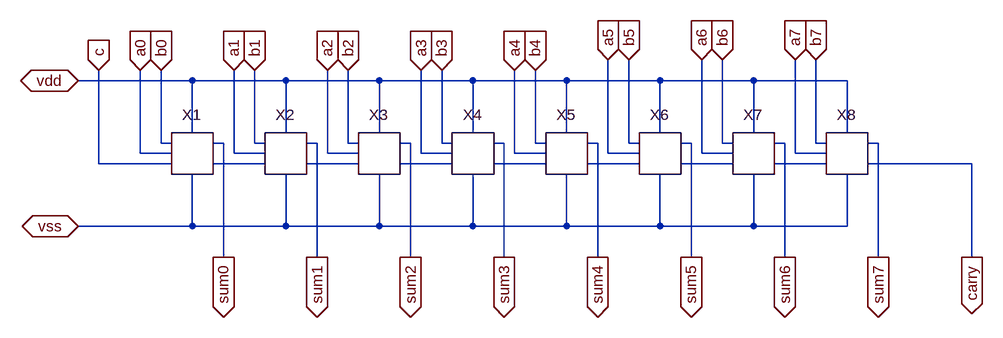
[diagram p0: schematic 8_bit_adder.asc]
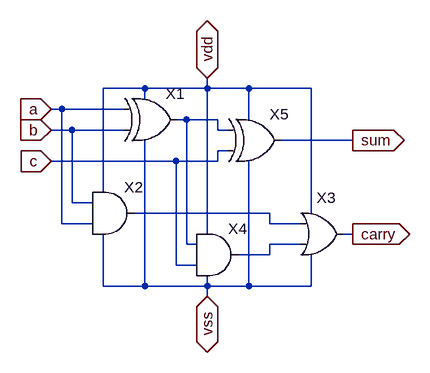
[diagram p1: sub-circuit full_adder.asc]
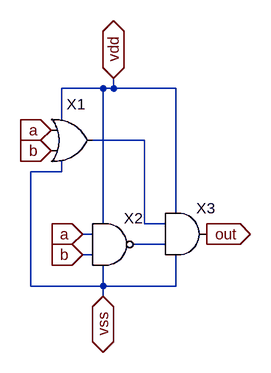
[diagram p2: sub-circuit xor.asc]
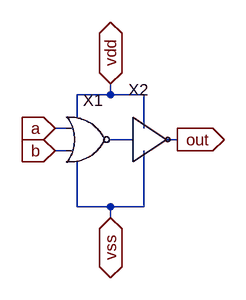
[diagram p3: sub-circuit or.asc]
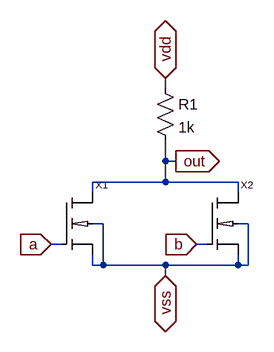
[diagram p4: sub-circuit nor.asc]
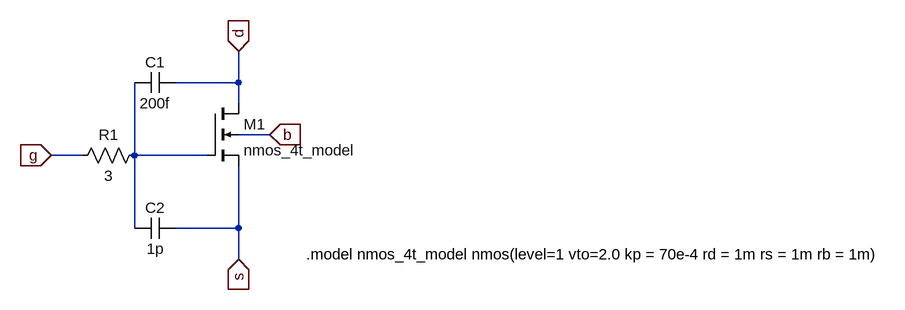
[diagram p5: sub-circuit nmos_4t.asc]
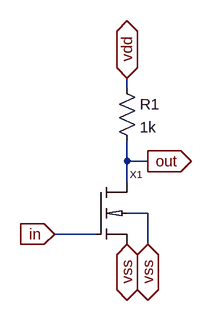
[diagram p6: sub-circuit not.asc]
8_bit_adder.asc, the LTspice schematic file:
Version 4
SHEET 1 1636 1396
WIRE 208 -96 32 -96
WIRE 352 -96 208 -96
WIRE 496 -96 352 -96
WIRE 640 -96 496 -96
WIRE 784 -96 640 -96
WIRE 928 -96 784 -96
WIRE 1072 -96 928 -96
WIRE 1216 -96 1072 -96
WIRE 208 -16 208 -96
WIRE 352 -16 352 -96
WIRE 496 -16 496 -96
WIRE 640 -16 640 -96
WIRE 784 -16 784 -96
WIRE 928 -16 928 -96
WIRE 1072 -16 1072 -96
WIRE 1216 -16 1216 -96
WIRE 160 0 160 -112
WIRE 176 0 160 0
WIRE 256 0 240 0
WIRE 304 0 304 -112
WIRE 320 0 304 0
WIRE 400 0 384 0
WIRE 448 0 448 -112
WIRE 464 0 448 0
WIRE 544 0 528 0
WIRE 592 0 592 -112
WIRE 608 0 592 0
WIRE 688 0 672 0
WIRE 736 0 736 -112
WIRE 752 0 736 0
WIRE 832 0 816 0
WIRE 880 0 880 -128
WIRE 896 0 880 0
WIRE 976 0 960 0
WIRE 1024 0 1024 -128
WIRE 1040 0 1024 0
WIRE 1120 0 1104 0
WIRE 1168 0 1168 -128
WIRE 1184 0 1168 0
WIRE 1264 0 1248 0
WIRE 128 16 128 -112
WIRE 176 16 128 16
WIRE 272 16 272 -112
WIRE 320 16 272 16
WIRE 416 16 416 -112
WIRE 464 16 416 16
WIRE 560 16 560 -112
WIRE 608 16 560 16
WIRE 704 16 704 -112
WIRE 752 16 704 16
WIRE 848 16 848 -128
WIRE 896 16 848 16
WIRE 992 16 992 -128
WIRE 1040 16 992 16
WIRE 1136 16 1136 -128
WIRE 1184 16 1136 16
WIRE 64 32 64 -112
WIRE 176 32 64 32
WIRE 320 32 240 32
WIRE 464 32 384 32
WIRE 608 32 528 32
WIRE 752 32 672 32
WIRE 896 32 816 32
WIRE 1040 32 960 32
WIRE 1184 32 1104 32
WIRE 1408 32 1248 32
WIRE 208 128 208 48
WIRE 208 128 32 128
WIRE 352 128 352 48
WIRE 352 128 208 128
WIRE 496 128 496 48
WIRE 496 128 352 128
WIRE 640 128 640 48
WIRE 640 128 496 128
WIRE 784 128 784 48
WIRE 784 128 640 128
WIRE 928 128 928 48
WIRE 928 128 784 128
WIRE 1072 128 1072 48
WIRE 1072 128 928 128
WIRE 1216 128 1216 48
WIRE 1216 128 1072 128
WIRE 256 176 256 0
WIRE 400 176 400 0
WIRE 544 176 544 0
WIRE 688 176 688 0
WIRE 832 176 832 0
WIRE 976 176 976 0
WIRE 1120 176 1120 0
WIRE 1264 176 1264 0
WIRE 1408 176 1408 32
FLAG 128 -112 a0
IOPIN 128 -112 In
FLAG 160 -112 b0
IOPIN 160 -112 In
FLAG 256 176 sum0
IOPIN 256 176 Out
FLAG 400 176 sum1
IOPIN 400 176 Out
FLAG 544 176 sum2
IOPIN 544 176 Out
FLAG 688 176 sum3
IOPIN 688 176 Out
FLAG 832 176 sum4
IOPIN 832 176 Out
FLAG 976 176 sum5
IOPIN 976 176 Out
FLAG 1120 176 sum6
IOPIN 1120 176 Out
FLAG 1264 176 sum7
IOPIN 1264 176 Out
FLAG 1408 176 carry
IOPIN 1408 176 Out
FLAG 272 -112 a1
IOPIN 272 -112 In
FLAG 304 -112 b1
IOPIN 304 -112 In
FLAG 416 -112 a2
IOPIN 416 -112 In
FLAG 448 -112 b2
IOPIN 448 -112 In
FLAG 560 -112 a3
IOPIN 560 -112 In
FLAG 592 -112 b3
IOPIN 592 -112 In
FLAG 704 -112 a4
IOPIN 704 -112 In
FLAG 736 -112 b4
IOPIN 736 -112 In
FLAG 848 -128 a5
IOPIN 848 -128 In
FLAG 880 -128 b5
IOPIN 880 -128 In
FLAG 992 -128 a6
IOPIN 992 -128 In
FLAG 1024 -128 b6
IOPIN 1024 -128 In
FLAG 1136 -128 a7
IOPIN 1136 -128 In
FLAG 1168 -128 b7
IOPIN 1168 -128 In
FLAG 32 -96 vdd
IOPIN 32 -96 BiDir
FLAG 32 128 vss
IOPIN 32 128 BiDir
FLAG 64 -112 c
IOPIN 64 -112 In
SYMBOL full_adder 208 0 R0
SYMATTR InstName X1
SYMBOL full_adder 352 0 R0
SYMATTR InstName X2
SYMBOL full_adder 496 0 R0
SYMATTR InstName X3
SYMBOL full_adder 640 0 R0
SYMATTR InstName X4
SYMBOL full_adder 784 0 R0
SYMATTR InstName X5
SYMBOL full_adder 928 0 R0
SYMATTR InstName X6
SYMBOL full_adder 1072 0 R0
SYMATTR InstName X7
SYMBOL full_adder 1216 0 R0
SYMATTR InstName X8

full_adder.asc, the sub-circuit schematic file:
Version 4
SHEET 1 880 680
WIRE 128 128 64 128
WIRE 224 128 224 112
WIRE 224 128 128 128
WIRE 288 128 224 128
WIRE 384 128 288 128
WIRE 128 144 128 128
WIRE 0 160 -16 160
WIRE 96 160 0 160
WIRE 192 176 176 176
WIRE 240 176 192 176
WIRE 288 176 288 128
WIRE 16 192 -16 192
WIRE 96 192 16 192
WIRE 240 192 240 176
WIRE 256 192 240 192
WIRE 448 208 336 208
WIRE 256 224 240 224
WIRE 176 240 -16 240
WIRE 240 240 240 224
WIRE 240 240 176 240
WIRE 64 288 64 128
WIRE 16 304 16 192
WIRE 48 304 16 304
WIRE 320 320 112 320
WIRE 384 320 384 128
WIRE 0 336 0 160
WIRE 48 336 0 336
WIRE 320 336 320 320
WIRE 368 336 320 336
WIRE 224 352 224 128
WIRE 448 352 432 352
WIRE 192 368 192 176
WIRE 208 368 192 368
WIRE 368 368 320 368
WIRE 320 384 320 368
WIRE 320 384 272 384
WIRE 176 400 176 240
WIRE 208 400 176 400
WIRE 64 432 64 352
WIRE 128 432 128 208
WIRE 128 432 64 432
WIRE 224 432 224 416
WIRE 224 432 128 432
WIRE 288 432 288 240
WIRE 288 432 224 432
WIRE 384 432 384 384
WIRE 384 432 288 432
WIRE 224 448 224 432
FLAG -16 160 a
IOPIN -16 160 In
FLAG -16 192 b
IOPIN -16 192 In
FLAG 224 448 vss
IOPIN 224 448 BiDir
FLAG 224 112 vdd
IOPIN 224 112 BiDir
FLAG -16 240 c
IOPIN -16 240 In
FLAG 448 208 sum
IOPIN 448 208 Out
FLAG 448 352 carry
IOPIN 448 352 Out
SYMBOL xor 144 112 R0
SYMATTR InstName X1
SYMBOL and 80 256 R0
SYMATTR InstName X2
SYMBOL and 240 320 R0
SYMATTR InstName X4
SYMBOL xor 304 144 R0
SYMATTR InstName X5
SYMBOL or 400 288 R0
SYMATTR InstName X3

xor.asc, the sub-circuit schematic file:
Version 4
SHEET 1 880 680
WIRE 208 -144 144 -144
WIRE 224 -144 224 -160
WIRE 224 -144 208 -144
WIRE 320 -144 224 -144
WIRE 144 -96 144 -144
WIRE 272 -64 192 -64
WIRE 144 -16 144 -32
WIRE 144 -16 96 -16
WIRE 320 48 320 -144
WIRE 208 64 208 -144
WIRE 272 64 272 -64
WIRE 304 64 272 64
WIRE 192 80 176 80
WIRE 304 96 256 96
WIRE 192 112 176 112
WIRE 96 160 96 -16
WIRE 208 160 208 128
WIRE 208 160 96 160
WIRE 320 160 320 112
WIRE 320 160 208 160
WIRE 208 176 208 160
FLAG 128 -80 a
IOPIN 128 -80 In
FLAG 176 80 a
IOPIN 176 80 In
FLAG 176 112 b
IOPIN 176 112 In
FLAG 128 -48 b
IOPIN 128 -48 In
FLAG 368 80 out
IOPIN 368 80 Out
FLAG 224 -160 vdd
IOPIN 224 -160 BiDir
FLAG 208 176 vss
IOPIN 208 176 BiDir
SYMBOL nand 224 32 R0
SYMATTR InstName X2
SYMBOL or 160 -128 R0
SYMATTR InstName X1
SYMBOL and 336 16 R0
SYMATTR InstName X3

or.asc, the sub-circuit schematic file:
Version 4
SHEET 1 880 680
WIRE 176 80 176 64
WIRE 176 80 128 80
WIRE 224 80 176 80
WIRE 128 112 128 80
WIRE 112 128 96 128
WIRE 224 128 224 80
WIRE 208 144 176 144
WIRE 272 144 256 144
WIRE 112 160 96 160
WIRE 128 240 128 176
WIRE 176 240 128 240
WIRE 224 240 224 160
WIRE 224 240 176 240
WIRE 176 256 176 240
FLAG 272 144 out
IOPIN 272 144 Out
FLAG 176 64 vdd
IOPIN 176 64 BiDir
FLAG 176 256 vss
IOPIN 176 256 BiDir
FLAG 96 128 a
IOPIN 96 128 In
FLAG 96 160 b
IOPIN 96 160 In
SYMBOL nor 144 80 R0
SYMATTR InstName X1
SYMBOL not 208 144 R0
SYMATTR InstName X2
SYMATTR Value ""

nor.asc, the sub-circuit schematic file:
Version 4
SHEET 1 880 680
WIRE 240 48 240 32
WIRE 240 160 240 128
WIRE 256 160 240 160
WIRE 240 192 240 160
WIRE 240 192 128 192
WIRE 352 192 240 192
WIRE 128 208 128 192
WIRE 352 208 352 192
WIRE 144 256 128 256
WIRE 368 256 352 256
WIRE 80 288 64 288
WIRE 304 288 288 288
WIRE 128 320 128 304
WIRE 144 320 144 256
WIRE 144 320 128 320
WIRE 240 320 144 320
WIRE 352 320 352 304
WIRE 352 320 240 320
WIRE 368 320 368 256
WIRE 368 320 352 320
WIRE 240 336 240 320
FLAG 240 32 vdd
IOPIN 240 32 BiDir
FLAG 240 336 vss
IOPIN 240 336 BiDir
FLAG 256 160 out
IOPIN 256 160 Out
FLAG 288 288 b
IOPIN 288 288 In
FLAG 64 288 a
IOPIN 64 288 In
SYMBOL res 224 32 R0
SYMATTR InstName R1
SYMATTR Value 1k
SYMBOL nmos_4t 80 208 R0
SYMATTR InstName X1
SYMBOL nmos_4t 304 208 R0
SYMATTR InstName X2

nmos_4t.asc, the sub-circuit schematic file:
Version 4
SHEET 1 880 680
WIRE -288 -224 -288 -272
WIRE -288 -224 -384 -224
WIRE -288 -192 -288 -224
WIRE -240 -144 -288 -144
WIRE -528 -112 -576 -112
WIRE -448 -112 -448 -224
WIRE -336 -112 -448 -112
WIRE -448 0 -448 -112
WIRE -288 0 -288 -96
WIRE -288 0 -384 0
WIRE -288 48 -288 0
FLAG -576 -112 g
IOPIN -576 -112 In
FLAG -288 -272 d
IOPIN -288 -272 In
FLAG -288 48 s
IOPIN -288 48 In
FLAG -240 -144 b
IOPIN -240 -144 In
SYMBOL nmos4 -336 -192 R0
SYMATTR InstName M1
SYMATTR Value nmos_4t_model
SYMBOL cap -384 -240 R90
WINDOW 0 0 32 VBottom 2
WINDOW 3 32 32 VTop 2
SYMATTR InstName C1
SYMATTR Value 200f
SYMBOL cap -384 -16 R90
WINDOW 0 0 32 VBottom 2
WINDOW 3 32 32 VTop 2
SYMATTR InstName C2
SYMATTR Value 1p
SYMBOL res -432 -128 R90
WINDOW 0 0 56 VBottom 2
WINDOW 3 32 56 VTop 2
SYMATTR InstName R1
SYMATTR Value 3
TEXT -184 40 Left 2 !.model nmos_4t_model nmos(level=1 vto=2.0 kp = 70e-4 rd = 1m rs = 1m rb = 1m)

not.asc, the sub-circuit schematic file:
Version 4
SHEET 1 880 680
WIRE 176 -96 176 -112
WIRE 176 16 176 -16
WIRE 208 16 176 16
WIRE 176 48 176 16
WIRE 208 96 176 96
WIRE 128 128 64 128
WIRE 208 144 208 96
FLAG 64 128 in
IOPIN 64 128 In
FLAG 176 144 vss
IOPIN 176 144 BiDir
FLAG 176 -112 vdd
IOPIN 176 -112 BiDir
FLAG 208 16 out
IOPIN 208 16 Out
FLAG 208 144 vss
IOPIN 208 144 BiDir
SYMBOL res 160 -112 R0
SYMATTR InstName R1
SYMATTR Value 1k
SYMBOL nmos_4t 128 48 R0
SYMATTR InstName X1

The netlist it stands for:
* 8_bit_adder.asc
XX1 b0 a0 c N001 sum0 vdd vss full_adder
XX2 b1 a1 N001 N002 sum1 vdd vss full_adder
XX3 b2 a2 N002 N003 sum2 vdd vss full_adder
XX4 b3 a3 N003 N004 sum3 vdd vss full_adder
XX5 b4 a4 N004 N005 sum4 vdd vss full_adder
XX6 b5 a5 N005 N006 sum5 vdd vss full_adder
XX7 b6 a6 N006 N007 sum6 vdd vss full_adder
XX8 b7 a7 N007 carry sum7 vdd vss full_adder

* block symbol definitions
.subckt full_adder a b c carry sum vdd vss
XX1 a b vdd vss N001 xor
XX2 b a vdd vss N002 and  ; pins a b vdd vss out
XX4 N001 c vdd vss N003 and  ; pins a b vdd vss out
XX5 N001 c vdd vss sum xor
XX3 N002 N003 carry vdd vss or
.ends full_adder

.subckt xor a b vdd vss out
XX2 a b vdd vss N002 nand  ; pins a b vdd vss out
XX1 a b N001 vdd vss or
XX3 N001 N002 vdd vss out and  ; pins a b vdd vss out
.ends xor

.subckt or a b out vdd vss
XX1 a b vdd vss N001 nor
XX2 N001 out vss vdd not
.ends or

.subckt nor a b vdd vss out
R1 vdd out 1k
XX1 out a vss vss nmos_4t
XX2 out b vss vss nmos_4t
.ends nor

.subckt nmos_4t D G S B
M1 d N001 s b nmos_4t_model
C1 d N001 200f
C2 s N001 1p
R1 N001 g 3
.model nmos_4t_model nmos(level=1 vto=2.0 kp = 70e-4 rd = 1m rs = 1m rb = 1m)
.ends nmos_4t

.subckt not in out vss vdd
R1 vdd out 1k
XX1 out in vss vss nmos_4t
.ends not

.model NMOS NMOS
.model PMOS PMOS
.lib standard.mos
.backanno
.end